# Altium schematic sheet Sheet1.SchDoc
size A4
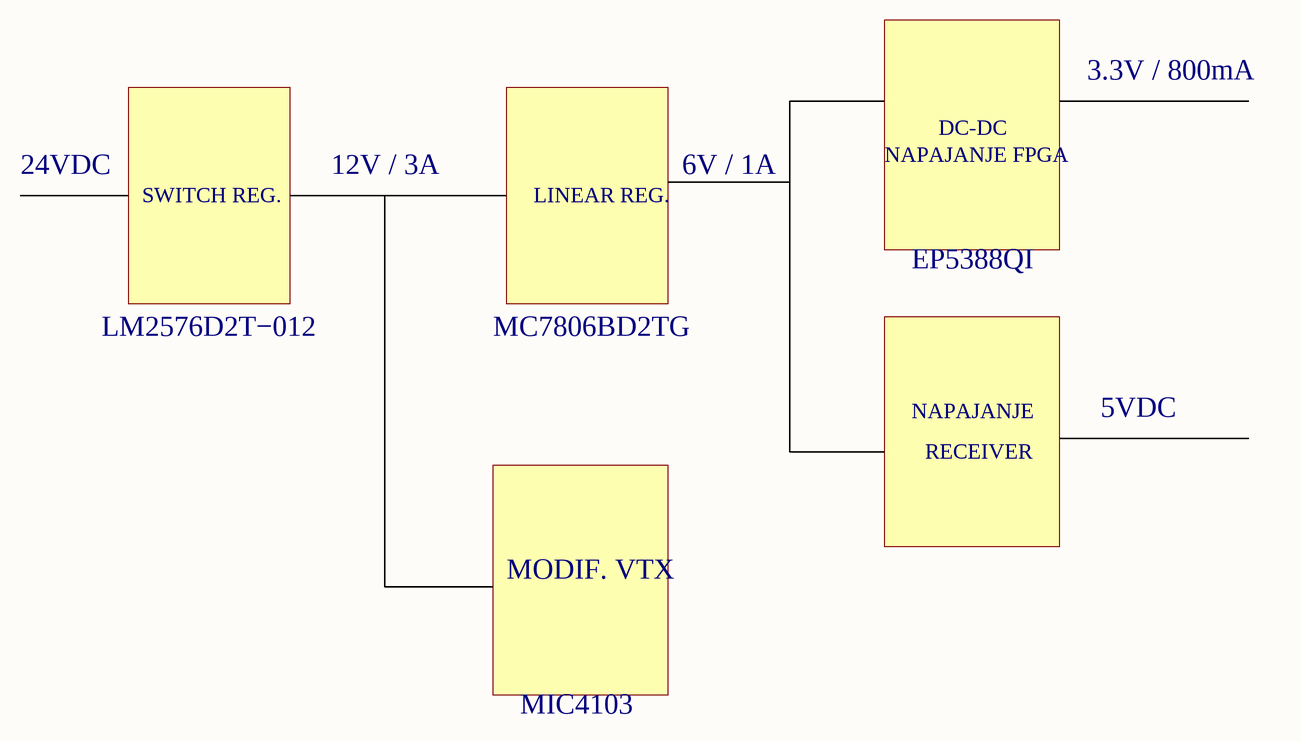
[diagram p0: Sheet1.SchDoc]

## Notes on the sheet
- 3.3V / 800mA
- 24VDC
- 12V / 3A
- 6V / 1A
- NAPAJANJE FPGA
- DC-DC
- SWITCH REG.
- LINEAR REG.
- EP5388QI
- LM2576D2T−012
- MC7806BD2TG
- NAPAJANJE
- 5VDC
- RECEIVER
- MODIF. VTX
- MIC4103